# EasyEDA Pro project STM32G474RBT6直插主控.eprj

# Schematic Schematic1
Board Name: Board1; Create Date: 2026-03-23; Page Name: P1; Project Name: STM32G474RBT6直插主控; Schematic Name: Schematic1; Update Date: 2026-03-25; Company: 嘉立创EDA; Page Size: A4; Version: V1.0
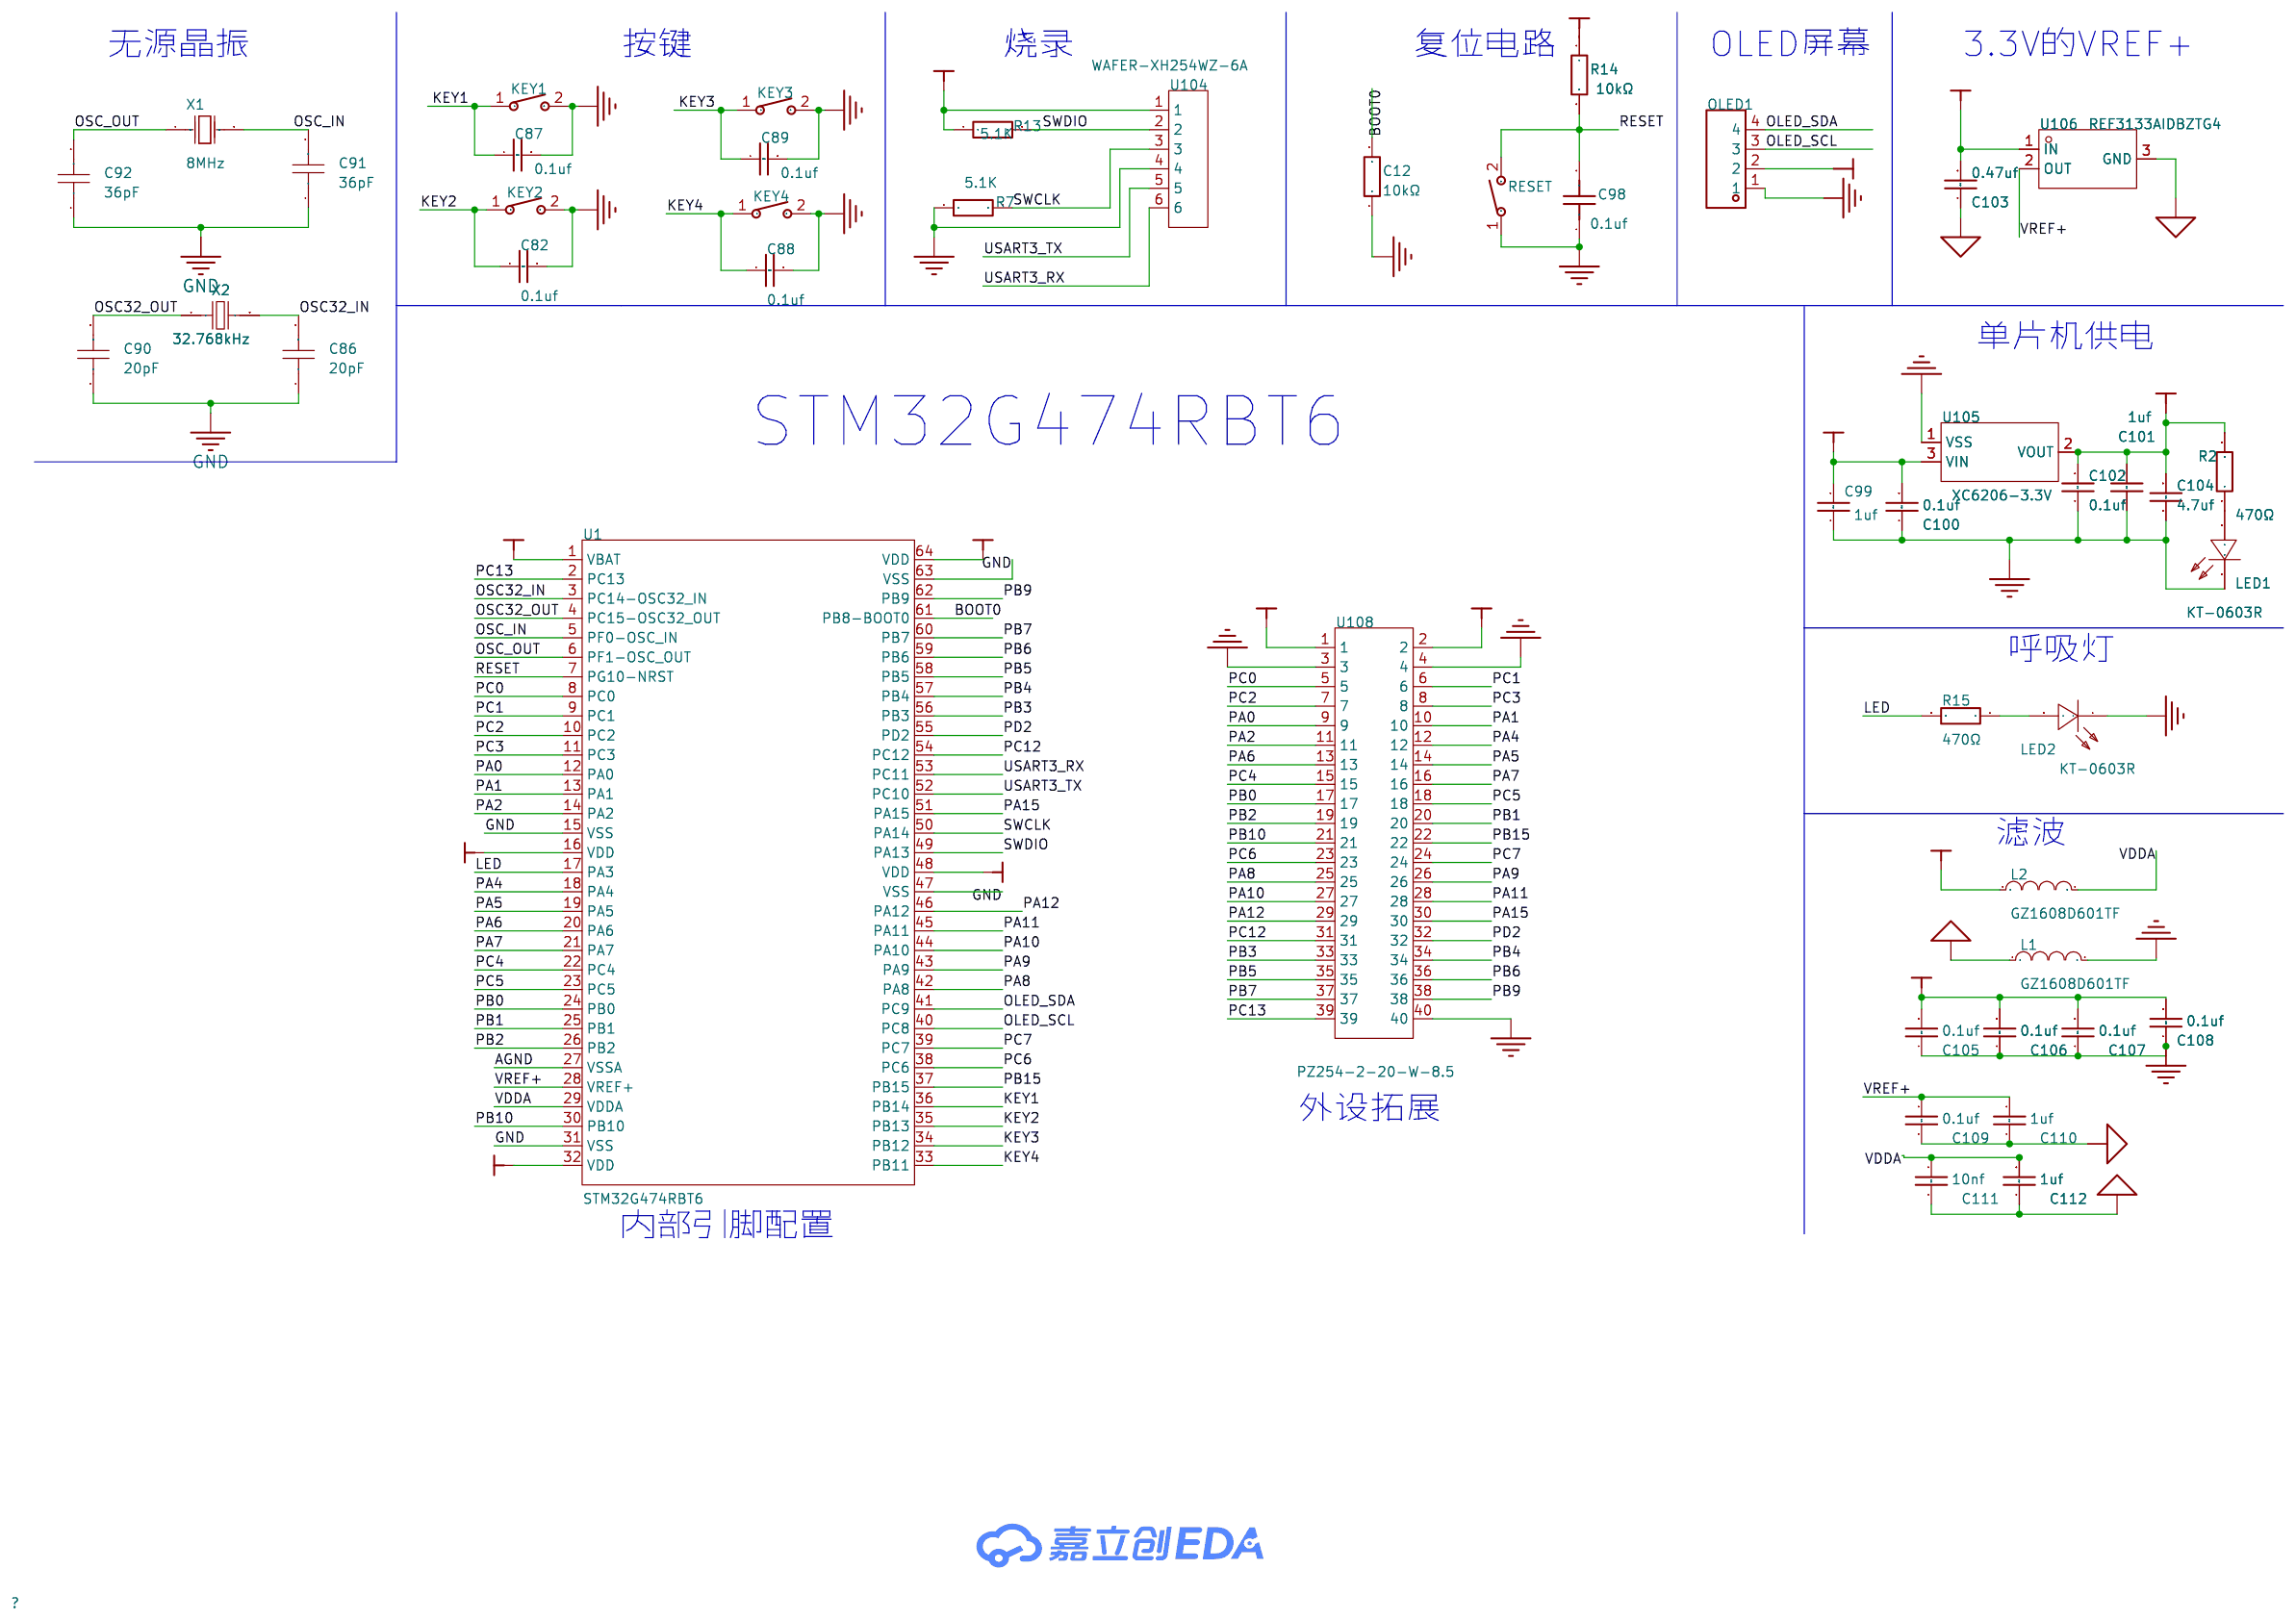
[diagram p0: schematic sheet]

## Parts
C12  10kΩ  [电阻（0603）]
C82  0.1uf  [C0603]
C86  20pF  [C0603]
C87  0.1uf  [C0603]
C88  0.1uf  [C0603]
C89  0.1uf  [C0603]
C90  20pF  [C0603]
C91  36pF  [C0603]
C92  36pF  [C0603]
C98  0.1uf  [电容（0603）]
C99  1uf  [C0603]
C100  0.1uf  [C0603]
C101  1uf  [C0603]
C102  0.1uf  [C0603]
C103  0.47uf  [C0603]
C104  4.7uf  [C0603]
C105  0.1uf  [C0603]
C106  0.1uf  [C0603]
C107  0.1uf  [C0603]
C108  0.1uf  [C0603]
C109  0.1uf  [C0603]
C110  1uf  [C0603]
C111  10nf  [C0603]
C112  1uf  [C0603]
KEY1  TS6643WS 250gf 072  [SW-SMD_L6.0-W6.0-P6.00-LS6.8]
KEY2  TS6643WS 250gf 072  [SW-SMD_L6.0-W6.0-P6.00-LS6.8]
KEY3  TS6643WS 250gf 072  [SW-SMD_L6.0-W6.0-P6.00-LS6.8]
KEY4  TS6643WS 250gf 072  [SW-SMD_L6.0-W6.0-P6.00-LS6.8]
L1  GZ1608D601TF  [L0603]
L2  GZ1608D601TF  [L0603]
LED1  KT-0603R  [LED0603-RD]
LED2  KT-0603R  [LED0603-RD]
OLED1  2.54-1*4P母  [HDR-TH_4P-P2.54-V-F]
R2  470Ω  [电阻（0603）]
R7  5.1K  [电阻（0603）]
R13  5.1K  [电阻（0603）]
R14  10kΩ  [电阻（0603）]
R15  470Ω  [电阻（0603）]
RESET  TS6643WS 250gf 072  [SW-SMD_L6.0-W6.0-P6.00-LS6.8]
U1  STM32G474RBT6  [LQFP-64_L10.0-W10.0-P0.50-LS12.0-BL]
U104  WAFER-XH254WZ-6A  [CONN-TH_6P-P2.50_WAFER-XH254WZ-6A]
U105  XC6206-3.3V  [SSOT-3_L2.9-W1.6-P0.95-LS2.8-BR]
U106  REF3133AIDBZTG4  [SOT-23-3_L2.9-W1.4-0.95-LS2.5-BR]
U108  PZ254-2-20-W-8.5  [HDR-TH_40P-P2.54-H-M-R2-C20-S2.54-W12.9-N]
X1  8MHz  [CRYSTAL-SMD_L5.0-W3.2]
X2  32.768kHz  [FC-135R_L3.2-W1.5]

## Library data of the parts
C12 = 0805W8F1002T5E_C17414: LCSC Part Name: 10kΩ ±1% 125mW; Supplier Part: C17414; Manufacturer: UNI-ROYAL(厚声); Manufacturer Part: 0805W8F1002T5E; Supplier Footprint: 0805; JLCPCB Part Class: Basic Part; Datasheet: https://atta.szlcsc.com/upload/public/pdf/source/20200306/C422600_1E6D84923E4A46A82E41ADD87F860B5C.pdf; Supplier: LCSC; Type: 厚膜电阻; Tolerance: ±1%; Power(Watts): 125mW; Temperature Coefficient: ±100ppm/℃; Overload Voltage (Max): 150V; Operating Temperature Range: -55℃~+155℃
C82 C87-C89 C99-C112 = C0603
C86 C90-C92 = CAI0603C0G470J101JT: 容值:47pF;精度:±5%;额定电压:100V;温度系数:C0G;; LCSC Part Name: 47pF ±5% 100V; Supplier Part: C46614508; Manufacturer: HRE(芯声); Supplier Footprint: 0603; JLCPCB Part Class: 扩展库; Datasheet: https://item.szlcsc.com/datasheet/CAI0603C0G470J101JT/48763034.html; Supplier: LCSC; Tolerance: ±5%; Voltage Rating: 100V; Temperature Coefficient: C0G
C98 = 电容
KEY1-KEY4 = TS6643WS 250gf 072: LCSC Part Name: 6*6*4.3mm 立贴 轻触开关 无声软胶; Supplier Part: C6364686; Manufacturer: SHOU HAN(首韩); Supplier Footprint: SMD; JLCPCB Part Class: 扩展库; Datasheet: https://atta.szlcsc.com/upload/public/pdf/source/20230523/7B21E479361B05F0C7B61E17A73CF12C.pdf; Supplier: LCSC; Circuit: 单刀单掷; Actuator Style: 圆形按钮; Operating Force: 2.5N; Mounting Style: 立贴; Switch Length: 6mm; Switch Width: 6mm; Switch Height: 4.3mm; Strike Gundam: 不带; Contact Current: 50mA; Voltage Rating (DC): 12V; Insulation Resistance: 100MΩ; Actuator/Cap Color: 黑色; With Lamp: 无; Mechanical Life: 10万次; Operating Temperature: -20℃~+70℃
L1 L2 = GZ1608D601TF: 阻抗@频率:600Ω@100MHz;误差:±25%;直流电阻(DCR):450mΩ;; LCSC Part Name: 单路 0603磁珠 阻抗600Ω@100MHz; Supplier Part: C1002; Manufacturer: Sunlord(顺络); Supplier Footprint: 0603; JLCPCB Part Class: 基础库; Datasheet: https://item.szlcsc.com/datasheet/GZ1608D601TF/1354.html; Supplier: LCSC; Impedance @ Frequency: 600Ω@100MHz; Tolerance: ±25%; DC Resistance(DCR): 450mΩ; Current Rating: 200mA; Number of Circuits: 1; Operating Temperature: -55℃~+125℃
LED1 LED2 = KT-0603R: 灯头类型:-;发光颜色:红色;正向压降(Vf):2.4V;功率:40mW;正向电流:20mA;波长:615nm~630nm;二极管配置:独立二极管;透镜颜色:无色透明透镜;色温:-;发光强度:300mcd;发光角度:120°;载带方式:-;工作温度:-40℃~+85℃;; LCSC Part Name: 0603 红灯 高亮; Supplier Part: C2286; Manufacturer: KENTO; Supplier Footprint: 0603; JLCPCB Part Class: 基础库; Datasheet: https://item.szlcsc.com/datasheet/KT-0603R/2659.html; Supplier: LCSC; Illumination Color: 红色; Voltage - Forward(Vf): 2.4V; Power(Watts): 40mW; Forward Current: 20mA; Wavelength - Dominant: 615nm~630nm; Peak Wavelength: 645nm; Diode Configuration: 独立二极管; Lens Color: 无色透明透镜; Luminous Intensity: 300mcd; Viewing Angle: 120°; Operating Temperature: -40℃~+85℃
OLED1 = 2.54-1*4P母: 插孔结构:1x4P;间距:2.54mm;行距:-;圆孔/方孔:方孔;安装类型:直插;排数:单排;总孔位数:4P;额定电流:3A;额定电压:-;插孔方向:顶部;塑高:-;触头材质:青铜;触头镀层:-;工作温度范围:-40℃~+105℃;焊接温度(最大值):-;; LCSC Part Name: 间距:2.54mm 1x4P 直插; Supplier Part: C2718488; Manufacturer: BOOMELE(博穆精密); Supplier Footprint: 插件,P=2.54mm; Datasheet: https://atta.szlcsc.com/upload/public/pdf/source/20210301/C2718488_F4427B881E42CAA8DDB0B1C12B3A522C.pdf; Supplier: LCSC; Holes Structure: 1x4P; Pitch: 2.54mm; Circular Hole / Square Hole: 方孔; Mounting Type: 直插; Number of Rows: 单排; Number of Holes: 4P; Current Rating (Max): 3A; Holes Direction: 顶部; Contact Material: 青铜; Operating Temperature Range: -40℃~+105℃
R2 R15 = 0805W8F5101T5E: 电阻类型:厚膜电阻;阻值:5.1kΩ;精度:±1%;功率:125mW;最大工作电压:150V;温度系数:±100ppm/℃;; LCSC Part Name: 5.1kΩ ±1% 125mW 厚膜电阻; Supplier Part: C27834; Manufacturer: UNI-ROYAL(厚声); Supplier Footprint: 0805; JLCPCB Part Class: Basic Part; Datasheet: https://atta.szlcsc.com/upload/public/pdf/source/20200306/C422600_1E6D84923E4A46A82E41ADD87F860B5C.pdf; Supplier: LCSC; Type: 厚膜电阻; Tolerance: ±1%; Power(Watts): 125mW; Overload Voltage (Max): 150V; Temperature Coefficient: ±100ppm/℃; Operating Temperature Range: -55℃~+155℃
R7 R13 R14 = 电阻
RESET = TS6643WS 250gf 072: 电路结构:单刀单掷;按钮形状:圆形按钮;作用力:2.5N;安装方式:立贴;开关长度:6mm;开关宽度:6mm;开关高度:4.3mm;带支架:不带;触点电流:50mA;额定电压(DC):12V;绝缘电阻:100MΩ;带灯:无;机械寿命:10万次;; LCSC Part Name: 6*6*4.3mm 立贴 轻触开关 无声软胶; Supplier Part: C6364686; Manufacturer: SHOU HAN(首韩); Supplier Footprint: SMD; JLCPCB Part Class: 扩展库; Datasheet: https://atta.szlcsc.com/upload/public/pdf/source/20230523/7B21E479361B05F0C7B61E17A73CF12C.pdf; Supplier: LCSC; Circuit: 单刀单掷; Actuator Style: 圆形按钮; Operating Force: 2.5N; Mounting Style: 立贴; Switch Length: 6mm; Switch Width: 6mm; Switch Height: 4.3mm; Strike Gundam: 不带; Contact Current: 50mA; Voltage Rating (DC): 12V; Insulation Resistance: 100MΩ; Actuator/Cap Color: 黑色; With Lamp: 无; Mechanical Life: 10万次; Operating Temperature: -20℃~+70℃
U1 = STM32G474RBT6: CPU内核:ARM-M4;CPU最大主频:170MHz;应用领域:-;; LCSC Part Name: 带DSP和FPU的170MHz主流ARM Cortex-M4 MCU，具有128 KB Flash存储器、数学加速器、高分辨率定时器和高模拟电平集成; Supplier Part: C529413; Manufacturer: ST(意法半导体); Supplier Footprint: LQFP-64(10x10); JLCPCB Part Class: 扩展库; Datasheet: https://item.szlcsc.com/datasheet/STM32G474RBT6/549641.html; Supplier: LCSC; CPU Core: ARM-M4; CPU Maximum Speed: 170MHz; Program Storage Size: 128KB; Program Memory Type: FLASH; Number of I/O: 52; ADC (Bit): 12bit; DAC (Bit): 12bit; Voltage - Supply: 1.71V~3.6V
U104 = WAFER-XH254WZ-6A: 插针结构:1x6P;间距:2.54mm;安装方式:弯插;参考系列:XH;总PIN数:6P;排数:1;每排PIN数:6;额定电流:3A;触头材质:黄铜;工作温度:-25℃~+85℃;; LCSC Part Name: 1x6P 间距:2.54mm 弯插 系列:XH; Supplier Part: C7432695; Manufacturer: HANBO(汉博); Supplier Footprint: 插件,P=2.5mm; JLCPCB Part Class: 扩展库; Datasheet: https://item.szlcsc.com/datasheet/WAFER-XH254WZ-6A/8437692.html; Supplier: LCSC; Pins Structure: 1x6P; Pitch: 2.54mm; Mounting Type: 弯插; Reference Series: XH; Number of Pins: 6P; Number of Rows: 1; Number of PINs Per Row: 6; Current Rating: 3A; Contact Material: 黄铜; Operating Temperature: -25℃~+85℃; Voltage Rating: 250V; Plastic Material: PA66; Flame Retardant Rating: UL94V-0
U105 = XC6206-3.3V: 输出类型:固定;工作电压:6V;输出电压:3.3V;输出电流:250mA;电源纹波抑制比(PSRR):-;输出极性:正极;; LCSC Part Name: 3.3V 250mA 6V; Supplier Part: C2891841; Manufacturer: YONGYUTAI(永裕泰); Supplier Footprint: SOT-23-3L; JLCPCB Part Class: 扩展库; Datasheet: https://item.szlcsc.com/datasheet/XC6206-3.3V/3119760.html; Supplier: LCSC; Output Type: 固定; Voltage - Supply: 6V; Output Voltage: 3.3V; Output Current: 250mA; Voltage Dropout: 400mV@(200mA); standby current: 3uA; Features: 过流保护; Operating Temperature: -40℃~+125℃@(Tj); Output Configuration: 正极; Number of Outputs: 1
U106 = REF3133AIDBZTG4: 输出类型:固定;工作电压:3.35V~5.5V;输出电压:3.3V;输出电流:10mA;精度:±0.2%;; Supplier Part: C21252151; Manufacturer: TI(德州仪器); Supplier: LCSC; Output Type: 固定; Voltage - Supply: 3.35V~5.5V; Output Voltage: 3.3V; Output Current: 10mA; Tolerance: ±0.2%; Reference Type: 串联; Quiescent Current: 115uA; Noise - 1/10Hz to 10Hz: 43uVp-p; Noise - 10Hz to 10kHz: 63uVrms; Operating Temperature: -40℃~+125℃
U108 = PZ254-2-20-W-8.5: 插针结构:2x20P;间距:2.54mm;行距:2.54mm;圆针/方针:方针;安装方式:弯插;排数:双排;总PIN位数:40P;额定电流:3A;额定电压:-;配合针长度:6mm;塑高:2.5mm;端接针长度:-;触头材质:黄铜;工作温度:-40℃~+105℃;颜色:黑色;; LCSC Part Name: 2x20P 间距:2.54mm 方针 弯插; Supplier Part: C3012279; Manufacturer: HCTL(华灿天禄); Supplier Footprint: 弯插,P=2.54mm; JLCPCB Part Class: 扩展库; Datasheet: https://atta.szlcsc.com/upload/public/pdf/source/20230609/1B60364E488FD8696AA7206A46578DEA.pdf; Supplier: LCSC; Pin Structure: 2x20P; Pitch: 2.54mm; Row Spacing: 2.54mm; Circluar Pins/Square Pins: 方针; Mounting Type: 弯插; Number of Rows: 双排; Number of Pins: 40P; Current Rating: 3A; Length of Mating Pin: 6mm; Insulation Height: 2.5mm; Contact Material: 黄铜; Operating Temperature: -40℃~+105℃; Color: 黑色
X1 = X50328MSB2GI: 晶振类型:贴片晶振;频率:8MHz;常温频差:±10ppm;负载电容:20pF;频率稳定度:±20ppm;; LCSC Part Name: 8MHz ±10ppm 20pF; Supplier Part: C115962; Manufacturer: YXC(扬兴晶振); Supplier Footprint: SMD5032; JLCPCB Part Class: 基础库; Datasheet: https://atta.szlcsc.com/upload/public/pdf/source/20240329/44922B0AF7B60E58E9B66993B6077277.pdf; Supplier: LCSC; Type: 贴片晶振; Normal temperature Frequency Tolerance: ±10ppm; Load Capacitance: 20pF; Frequency Stability: ±20ppm; Operating Temperature: -40℃~+85℃
X2 = Q13FC1350000400: 晶振类型:贴片无源晶振;频率:32.768kHz;频率公差:±20ppm;频率稳定度:-;负载电容:12.5pF;等效串联电阻(ESR):70kΩ;工作温度:-40~+85;; LCSC Part Name: 32.768kHz ±20ppm 12.5pF; Supplier Part: C32346; Manufacturer: EPSON(爱普生); Supplier Footprint: SMD3215-2P; JLCPCB Part Class: Basic Part; Datasheet: https://atta.szlcsc.com/upload/public/pdf/source/20190108/C32346_746D6B07EAF90824457A96480007685F.pdf; Supplier: LCSC; Crystal Type: 贴片无源晶振; Frequency Tolerance: ±20ppm; Load Capacitance: 12.5pF; Equivalent Series Resistance (ESR): 70kΩ; Operating Temperature: -40~+85

## Nets
3V3: C101.2 C102.2 C104.2 C105.2 C106.2 C107.2 C108.2 L2.1 OLED1.2 R2.2 R13.1 R14.1 U1.1(VBAT) U1.16(VDD) U1.32(VDD) U1.48(VDD) U1.64(VDD) U104.1 U105.2(VOUT)
5V: C99.2 C100.2 C103.2 U105.3(VIN) U106.1(IN) U108.1 U108.2
AGND: C103.1 C109.1 C110.1 C111.1 C112.1 L1.1 U1.27(VSSA) U106.3(GND)
GND: C12.1 C82.2 C86.1 C87.2 C88.2 C89.2 C90.1 C91.1 C92.1 C98.1 C99.1 C100.1 C101.1 C102.1 C104.1 C105.1 C106.1 C107.1 C108.1 KEY1.2 KEY2.2 KEY3.2 KEY4.2 L1.2 LED1.1(K) LED2.1(K) OLED1.1 R7.1 RESET.1 U1.15(VSS) U1.31(VSS) U1.47(VSS) U1.63(VSS) U104.4 U105.1(VSS) U108.3 U108.4 U108.40
VDDA: C111.2 C112.2 L2.2 U1.29(VDDA)
BOOT0: C12.2 U1.61(PB8-BOOT0)
KEY1: C87.1 KEY1.1 U1.36(PB14)
KEY2: C82.1 KEY2.1 U1.35(PB13)
KEY3: C89.1 KEY3.1 U1.34(PB12)
KEY4: C88.1 KEY4.1 U1.33(PB11)
LED: R15.2 U1.17(PA3)
OLED_SCL: OLED1.3 U1.40(PC8)
OLED_SDA: OLED1.4 U1.41(PC9)
OSC32_IN: C86.2 U1.3(PC14-OSC32_IN) X2.2
OSC32_OUT: C90.2 U1.4(PC15-OSC32_OUT) X2.1
OSC_IN: C91.2 U1.5(PF0-OSC_IN) X1.2(OSC2)
OSC_OUT: C92.2 U1.6(PF1-OSC_OUT) X1.1(OSC1)
PA0: U1.12(PA0) U108.9
PA1: U1.13(PA1) U108.10
PA2: U1.14(PA2) U108.11
PA4: U1.18(PA4) U108.12
PA5: U1.19(PA5) U108.14
PA6: U1.20(PA6) U108.13
PA7: U1.21(PA7) U108.16
PA8: U1.42(PA8) U108.25
PA9: U1.43(PA9) U108.26
PA10: U1.44(PA10) U108.27
PA11: U1.45(PA11) U108.28
PA12: U1.46(PA12) U108.29
PA15: U1.51(PA15) U108.30
PB0: U1.24(PB0) U108.17
PB1: U1.25(PB1) U108.20
PB2: U1.26(PB2) U108.19
PB3: U1.56(PB3) U108.33
PB4: U1.57(PB4) U108.34
PB5: U1.58(PB5) U108.35
PB6: U1.59(PB6) U108.36
PB7: U1.60(PB7) U108.37
PB9: U1.62(PB9) U108.38
PB10: U1.30(PB10) U108.21
PB15: U1.37(PB15) U108.22
PC0: U1.8(PC0) U108.5
PC1: U1.9(PC1) U108.6
PC2: U1.10(PC2) U108.7
PC3: U1.11(PC3) U108.8
PC4: U1.22(PC4) U108.15
PC5: U1.23(PC5) U108.18
PC6: U1.38(PC6) U108.23
PC7: U1.39(PC7) U108.24
PC12: U1.54(PC12) U108.31
PC13: U1.2(PC13) U108.39
PD2: U1.55(PD2) U108.32
RESET: C98.2 R14.2 RESET.2 U1.7(PG10-NRST)
SWCLK: R7.2 U1.50(PA14) U104.3
SWDIO: R13.2 U1.49(PA13) U104.2
USART3_RX: U1.53(PC11) U104.6
USART3_TX: U1.52(PC10) U104.5
VREF+: C109.2 C110.2 U1.28(VREF+) U106.2(OUT)
$1N2899: LED1.2(A) R2.1
$1N3104: LED2.2(A) R15.1

## Notes on the sheet
- OLED屏幕
- 3.3V的VREF+
- 无源晶振
- 按键
- 烧录
- 复位电路
- 单片机供电
- STM32G474RBT6
- 呼吸灯
- 滤波
- 外设拓展
- 内部引脚配置

# Board PCB1
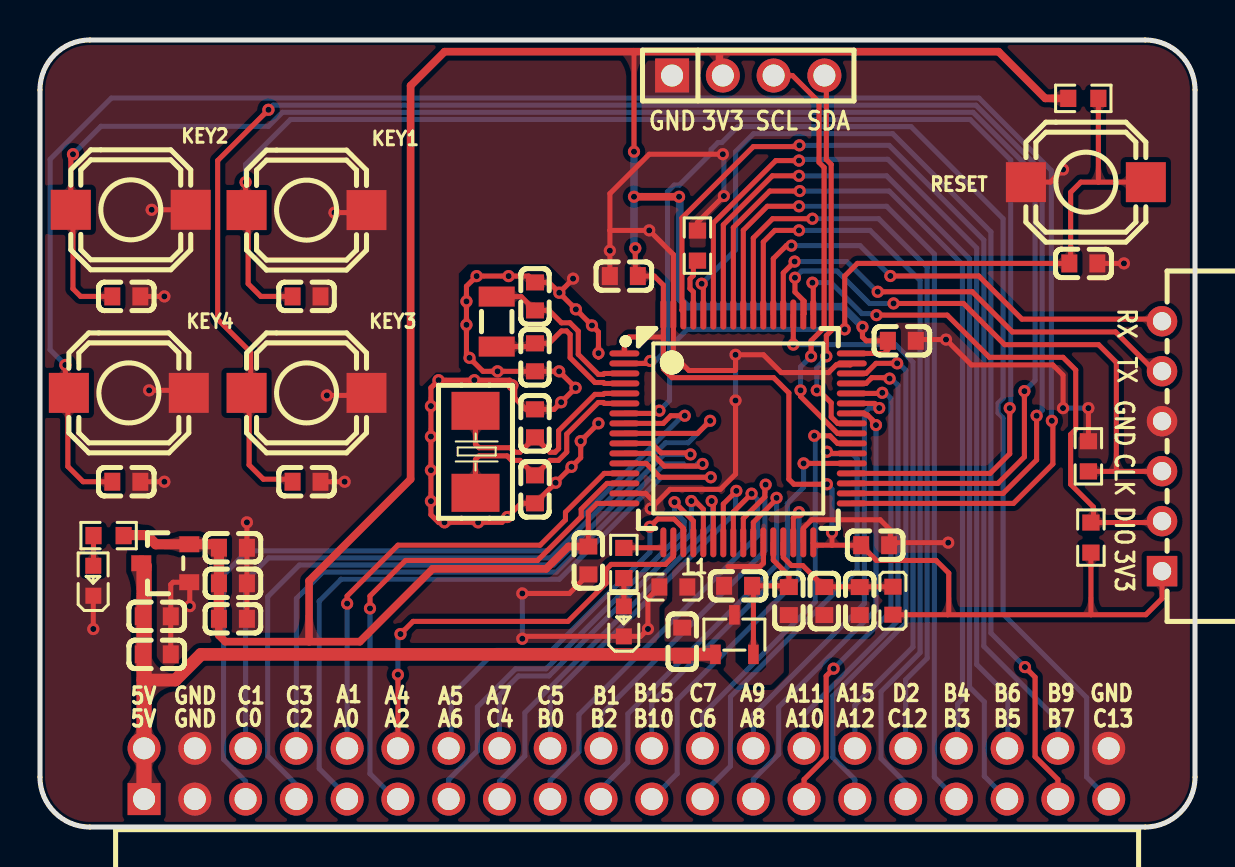
[diagram p1: board, top side]
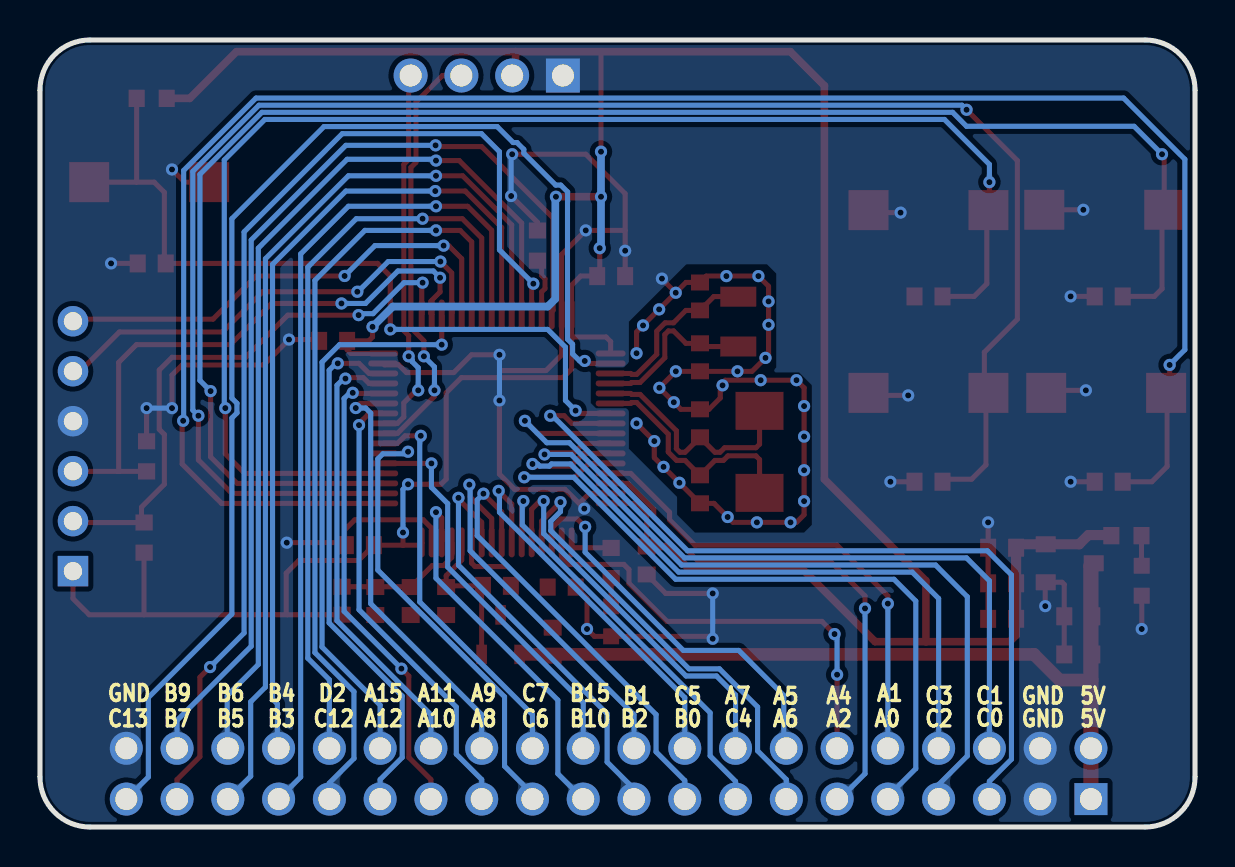
[diagram p2: board, bottom side, seen from below]

Outline 57.78 x 39.37 mm; copper layers: Top Layer, Bottom Layer. Coordinates in mm from the lower left corner of the outline.
Outline path: 0,36.87 0,2.5 arc(0.73,0.73) 2.5,0 55.28,0 arc(57.05,0.73) 57.78,2.5 57.78,36.87 arc(57.05,38.64) 55.28,39.37 2.5,39.37 arc(0.73,38.64) 0,36.87
Stack: Top Layer 0.035mm / Dielectric1 1.51mm FR4 er 4.5 / Bottom Layer 0.035mm

## Design rules (mm)
net OSC32_IN: DP1
net OSC32_OUT: DP1
net OSC_IN: DP2
net OSC_OUT: DP2
template: 自定义配置
spacing copperThickness1oz (default): track to track 0.102, other pairs 0.152 to 0.3
spacing copperThickness2oz: track to track 0.203, other pairs 0.152 to 0.3
track width copperThickness1oz (default): min 0.127, default 0.254, max 2.54
track width copperThickness2oz: min 0.203, default 0.254, max 2.54
differential pair differentialPair (default): width min 0.127, default 0.254, max 2.54; gap min 0.152, default 0.152
via viaSize (default): diameter min 0.5, default 0.61, max 10; hole min 0.3, default 0.305, max 6.3

## Placement (name value [footprint] x y rotation side)
C12  10kΩ  [电阻（0603）]  32.89 29.08 270 top
C82  0.1uf  [C0603]  4.32 26.54 0 top
C86  20pF  [C0603]  24.77 26.54 270 top
C87  0.1uf  [C0603]  13.34 26.54 0 top
C88  0.1uf  [C0603]  4.32 17.27 0 top
C89  0.1uf  [C0603]  13.34 17.27 0 top
C90  20pF  [C0603]  24.77 23.5 90 top
C91  36pF  [C0603]  24.77 20.19 270 top
C92  36pF  [C0603]  24.77 16.89 90 top
C98  0.1uf  [电容（0603）]  52.2 28.19 180 top
C99  1uf  [C0603]  5.84 8.64 180 top
C100  0.1uf  [C0603]  5.84 10.54 180 top
C101  1uf  [C0603]  9.65 12.19 180 top
C102  0.1uf  [C0603]  9.65 13.97 180 top
C103  0.47uf  [C0603]  32.13 9.27 270 top
C104  4.7uf  [C0603]  9.65 10.41 180 top
C105  0.1uf  [C0603]  41.78 14.1 180 top
C106  0.1uf  [C0603]  27.43 13.34 90 top
C107  0.1uf  [C0603]  29.21 27.56 0 top
C108  0.1uf  [C0603]  43.12 24.32 180 top
C109  0.1uf  [C0603]  34.93 12.07 0 top
C110  1uf  [C0603]  37.47 11.3 90 top
C111  10nf  [C0603]  41.01 11.3 90 top
C112  1uf  [C0603]  39.24 11.3 90 top
KEY1  TS6643WS 250gf 072  [SW-SMD_L6.0-W6.0-P6.00-LS6.8]  13.34 30.86 0 top
KEY2  TS6643WS 250gf 072  [SW-SMD_L6.0-W6.0-P6.00-LS6.8]  4.54 30.88 0 top
KEY3  TS6643WS 250gf 072  [SW-SMD_L6.0-W6.0-P6.00-LS6.8]  13.34 21.72 0 top
KEY4  TS6643WS 250gf 072  [SW-SMD_L6.0-W6.0-P6.00-LS6.8]  4.45 21.72 0 top
L1  GZ1608D601TF  [L0603]  31.69 12 180 top
L2  GZ1608D601TF  [L0603]  42.67 11.32 90 top
LED1  KT-0603R  [LED0603-RD]  2.67 12.32 90 top
LED2  KT-0603R  [LED0603-RD]  29.21 10.29 90 top
OLED1  2.54-1*4P母  [HDR-TH_4P-P2.54-V-F]  35.43 37.59 0 top
R2  470Ω  [电阻（0603）]  3.43 14.58 180 top
R7  5.1K  [电阻（0603）]  52.45 18.54 270 top
R13  5.1K  [电阻（0603）]  52.58 14.48 90 top
R14  10kΩ  [电阻（0603）]  52.2 36.45 0 top
R15  470Ω  [电阻（0603）]  29.21 13.21 90 top
RESET  TS6643WS 250gf 072  [SW-SMD_L6.0-W6.0-P6.00-LS6.8]  52.32 32.26 0 top
U1  STM32G474RBT6  [LQFP-64_L10.0-W10.0-P0.50-LS12.0-BL]  34.93 19.94 270 top
U104  WAFER-XH254WZ-6A  [CONN-TH_6P-P2.50_WAFER-XH254WZ-6A]  56.13 19.05 90 top
U105  XC6206-3.3V  [SSOT-3_L2.9-W1.6-P0.95-LS2.8-BR]  6.27 13.19 0 top
U106  REF3133AIDBZTG4  [SOT-23-3_L2.9-W1.4-0.95-LS2.5-BR]  34.74 9.62 270 top
U108  PZ254-2-20-W-8.5  [HDR-TH_40P-P2.54-H-M-R2-C20-S2.54-W12.9-N]  29.34 2.67 0 top
X1  8MHz  [CRYSTAL-SMD_L5.0-W3.2]  21.79 18.77 90 top
X2  32.768kHz  [FC-135R_L3.2-W1.5]  22.85 25.28 90 top

## Footprints (pads in the part's own frame, mm; a bottom-side part is the same pattern mirrored in y, then rotated)
C0603
  rect 0.8x0.9 smd: 1(-0.7,0) 2(0.7,0)
CONN-TH_6P-P2.50_WAFER-XH254WZ-6A
  rect 1.524x1.524 hole 0.914: 1(-6.25,0)
  round 1.524 hole 0.914: 2(-3.75,0) 3(-1.25,0) 4(1.25,0) 5(3.75,0) 6(6.25,0)
CRYSTAL-SMD_L5.0-W3.2
  rect 1.9x2.4 smd: 1(-2.05,0) 2(2.05,0)
FC-135R_L3.2-W1.5
  rect 1.001x1.801 smd: 1(-1.25,0) 2(1.25,0)
HDR-TH_4P-P2.54-V-F
  rect 1.7x1.7 hole 1.1: 1(-3.81,0)
  round 1.7 hole 1.1: 2(-1.27,0) 3(1.27,0) 4(3.81,0)
HDR-TH_40P-P2.54-H-M-R2-C20-S2.54-W12.9-N
  rect 1.65x1.6 hole 1.1: 1(-24.13,-1.27)
  round 1.65 hole 1.1: 2(-24.13,1.27) 3(-21.59,-1.27) 4(-21.59,1.27) 5(-19.05,-1.27) 6(-19.05,1.27) 7(-16.51,-1.27) 8(-16.51,1.27) 9(-13.97,-1.27) 10(-13.97,1.27) 11(-11.43,-1.27) 12(-11.43,1.27) 13(-8.89,-1.27) 14(-8.89,1.27) 15(-6.35,-1.27) 16(-6.35,1.27) 17(-3.81,-1.27) 18(-3.81,1.27) 19(-1.27,-1.27) 20(-1.27,1.27) 21(1.27,-1.27) 22(1.27,1.27) 23(3.81,-1.27) 24(3.81,1.27) 25(6.35,-1.27) 26(6.35,1.27) 27(8.89,-1.27) 28(8.89,1.27) 29(11.43,-1.27) 30(11.43,1.27) 31(13.97,-1.27) 32(13.97,1.27) 33(16.51,-1.27) 34(16.51,1.27) 35(19.05,-1.27) 36(19.05,1.27) 37(21.59,-1.27) 38(21.59,1.27) 39(24.13,-1.27) 40(24.13,1.27)
L0603
  rect 0.8x0.864 smd: 1(-0.7,0) 2(0.7,0)
LED0603-RD
  rect 0.8x0.8 smd: 1(-0.749,0) 2(0.749,0)
LQFP-64_L10.0-W10.0-P0.50-LS12.0-BL
  oval 0.3x1.5 smd: 1(-3.75,-5.688) 2(-3.25,-5.688) 3(-2.75,-5.688) 4(-2.25,-5.688) 5(-1.75,-5.688) 6(-1.25,-5.688) 7(-0.75,-5.688) 8(-0.25,-5.688) 9(0.25,-5.688) 10(0.75,-5.688) 11(1.25,-5.688) 12(1.75,-5.688) 13(2.25,-5.688) 14(2.75,-5.688) 15(3.25,-5.688) 16(3.75,-5.688) 33(3.75,5.688) 34(3.25,5.688) 35(2.75,5.688) 36(2.25,5.688) 37(1.75,5.688) 38(1.25,5.688) 39(0.75,5.688) 40(0.25,5.688) 41(-0.25,5.688) 42(-0.75,5.688) 43(-1.25,5.688) 44(-1.75,5.688) 45(-2.25,5.688) 46(-2.75,5.688) 47(-3.25,5.688) 48(-3.75,5.688)
  oval 1.5x0.3 smd: 17(5.7,-3.738) 18(5.7,-3.238) 19(5.7,-2.738) 20(5.7,-2.238) 21(5.7,-1.738) 22(5.7,-1.238) 23(5.7,-0.739) 24(5.7,-0.238) 25(5.7,0.262) 26(5.7,0.762) 27(5.7,1.262) 28(5.7,1.762) 29(5.7,2.261) 30(5.7,2.762) 31(5.7,3.261) 32(5.7,3.762) 49(-5.7,3.762) 50(-5.7,3.261) 51(-5.7,2.762) 52(-5.7,2.261) 53(-5.7,1.762) 54(-5.7,1.262) 55(-5.7,0.762) 56(-5.7,0.262) 57(-5.7,-0.238) 58(-5.7,-0.739) 59(-5.7,-1.238) 60(-5.7,-1.738) 61(-5.7,-2.238) 62(-5.7,-2.738) 63(-5.7,-3.238) 64(-5.7,-3.738)
SOT-23-3_L2.9-W1.4-0.95-LS2.5-BR
  rect 0.978x0.532 smd: 1(0.989,-0.95) 2(0.989,0.95) 3(-0.989,0)
SSOT-3_L2.9-W1.6-P0.95-LS2.8-BR
  rect 1x0.8 smd: 1(1.2,-0.95) 2(1.2,0.95) 3(-1.2,0)
SW-SMD_L6.0-W6.0-P6.00-LS6.8
  rect 2x2 smd: 1(-3,0) 2(3,0)
电容（0603）
  rect 0.8x0.9 smd: 1(-0.7,0) 2(0.7,0)
电阻（0603）
  rect 0.806x0.864 smd: 1(-0.754,0) 2(0.752,0)

## Nets
As in the schematic.

## Via types
v1: diameter 0.61, hole 0.305, Top Layer to Bottom Layer, 121 vias

## Routing (per net, layer and track width the routed paths; a pad name or vN(x,y) marks a point on that pad's centre or on a via; arc(x,y) is an arc through that point)
3V3: length 184.1
  Top Layer w0.254: 31.19,24.5 31.19,22.92 31.62,22.48 36.7,22.48 37.47,21.72 37.47,17.4 37.72,17.15 v1(39.37,17.15) ; 31.19,24.5 31.18,24.51 29.46,24.51 29.24,24.28 U1.1 ; 31.19,24.5 U1.64 31.19,27.11 30.73,27.56 C107.2 29.78,27.69 v1(29.78,28.96) ; L2.1 45.41,10.62 ; 45.41,10.62 55.32,10.62 56.13,11.43 U104.1 ; 45.41,10.62 45.47,10.68 45.47,12.7 44.83,13.34 41.84,13.34 41.08,14.1 39.62,14.1 ; U1.32 38.69,14.19 38.78,14.1 39.62,14.1 ; 39.62,14.1 v1(39.62,14.73) ; R13.1 52.58,10.62 ; U1.16 27.87,16.19 27.43,15.75 C106.2 ; v1(41.15,25.02) 41.15,24.51 41.34,24.32 C108.2 42.42,23.88 42.23,23.69 U1.48 ; 29.7,38.78 29.72,38.77 v1(29.72,33.78)
  Top Layer w0.381: 33.99,38.78 47.96,38.78 50.29,36.45 R14.1 ; 33.99,38.78 20.24,38.78 18.54,37.08 18.54,17.4 13.46,12.32 13.46,9.27 ; 33.99,38.78 33.99,37.9 ; C104.2 8.95,9.59 9.27,9.27 13.46,9.27 ; 13.46,9.27 16,9.27 19.65,12.92 25.32,12.92 26.44,14.04 C106.2 ; v1(31.97,31.53) v1(29.72,31.53)
  Top Layer w0.508: 4.18,14.58 4.21,14.61 5.33,14.61 5.79,14.14 U105.2 8.78,14.14 C102.2 C101.2 C104.2
  Bottom Layer w0.254: v1(39.62,14.73) 39.62,16.89 v1(39.37,17.15)
  Bottom Layer w0.381: v1(29.78,28.96) 29.72,29.02 v1(29.72,31.53) v1(29.72,33.78) ; v1(41.15,25.02) 40.13,26.04 32.38,26.04 32,26.42 32,31.5 v1(31.97,31.53)
5V: length 41
  Top Layer w0.635: 33.79,8.64 8.06,8.64 6.77,7.35 5.21,7.35
  Top Layer w0.762: 5.21,1.4 5.21,13.06 U105.3
AGND: length 2.9
  Top Layer w0.254: U1.27 36.19,14.23 36.19,13.21 36.02,13.03 34.42,13.03
GND: length 157.2
  Top Layer w0.254: v1(34.21,31.56) 32.89,30.24 C12.1 ; C107.1 v1(28.51,28.83) 28.51,29.85 ; v1(45.44,14.22) 42.61,14.22 42.55,14.16 ; 30.73,16.11 30.73,16.26 30.3,16.69 U1.15 ; 30.73,16.11 v1(30.55,15.93) ; 30.73,16.11 31.52,16.89 34.04,16.89 34.8,17.65 v1(34.8,21.34) ; C98.1 v1(54.23,28.19) ; 16.46,21.84 16.21,21.59 v1(14.35,21.59) ; v1(51.18,20.96) 51.18,22.61 50.67,23.11 46.6,23.11 v1(45.33,24.38) 43.88,24.38 C108.1 ; 30.61,29.72 31.69,28.64 U1.63 31.69,23.61 32.47,22.84 34.77,22.84 34.8,22.86 v1(34.8,23.62) 36.19,23.62 37.08,22.73 39.45,22.73 39.84,23.12 40.54,23.12 U1.47 ; KEY4.2 7.32,21.84 v1(5.46,21.84) ; C105.1 42.55,14.16 ; 42.55,14.16 42.55,14.86 42.04,15.37 38.61,15.37 38.19,14.95 U1.31 ; v1(14.73,30.73) 16.21,30.73 KEY1.2 ; v1(27.94,20.19) v1(27.05,19.3) 27.05,18.48 v1(26.59,18.02) v1(25.8,17.22) C92.1 24.06,16.19 v1(23.38,15.51) 23.11,15.24 v1(21.92,15.24) 19.94,15.24 19.56,15.62 v1(19.56,16.3) v1(19.56,17.85) v1(19.56,19.53) v1(19.56,21.06) 19.56,21.97 v1(19.94,22.35) v1(21.73,22.35) 23.5,22.35 23.75,22.1 23.75,21.46 24.32,20.89 C91.1 25.72,20.89 v1(26.07,21.25) v1(26.8,21.97) v1(25.97,22.8) C90.1 v1(22.89,22.8) 22.16,22.8 21.34,23.62 v1(21.34,25.12) v1(21.34,26.29) 21.34,27.05 v1(21.84,27.56) v1(23.44,27.56) 24.45,27.56 C86.1 25.46,27.24 v1(25.98,26.73) ; R7.1 v1(52.45,20.96) ; L1.2 30.42,11.44 v1(30.42,9.91) 30.05,9.54 LED2.1 24.25,9.54 v1(24.13,9.42) ; v1(24.13,11.68) 26.48,11.68 C106.1 ; C104.1 C101.1 C102.1 v1(10.35,15.24) ; 28.51,29.85 28.51,31.69 30.48,33.66 v1(34.16,33.66) ; 28.51,29.85 v1(30.48,29.85) ; LED1.1 v1(2.67,9.91) ; C88.2 v1(6.22,17.27) ; 27.94,23.5 27.94,24.77 v1(27.61,25.09) v1(26.81,25.9) v1(25.98,26.73) ; KEY2.2 v1(5.59,30.88) ; v1(25.98,26.73) 26.67,27.42 v1(26.67,27.43) ; v1(51.18,32.89) 50.55,32.26 RESET.1 ; v1(7.49,11.05) 7.49,12.22 U105.1 6.66,12.24 6.54,12.13 C100.1 C99.1 ; C82.2 v1(6.22,26.54) ; C89.2 v1(15.24,17.27)
  Top Layer w0.381: 31.24,37.47 31.62,37.85
  Bottom Layer w0.254: v1(34.16,33.66) 34.21,33.6 v1(34.21,31.56) ; v1(34.8,21.34) v1(34.8,23.62) ; v1(51.18,20.96) v1(52.45,20.96) ; v1(24.13,9.42) v1(24.13,11.68)
  vias: v1(20.24,15.24) v1(21.49,23.47) v1(23.64,22.09) v1(27.94,23.7)
VDDA: length 6.9
  Top Layer w0.254: L2.2 39.25,12.02 C112.2 38.16,13.08 37.59,13.08 37.19,13.49 U1.29
BOOT0: length 2.9
  Top Layer w0.254: U1.61 32.69,26.77 32.52,26.94 32.52,27.42 32.69,27.59 32.69,28.12 C12.2
KEY1: length 72.1
  Top Layer w0.254: 10.29,31.3 10.41,31.17 10.41,27.18 11.05,26.54 12.51,26.54 12.63,26.67 ; 10.29,31.3 10.29,30.91 KEY1.1 ; 10.29,31.3 v1(10.29,32.26) ; U1.36 47.53,17.69 48.51,18.67 v1(48.51,20.96)
  Bottom Layer w0.254: v1(10.29,32.26) 10.29,33.15 12.53,35.4 46.53,35.4 48.56,33.36 48.56,21.01 v1(48.51,20.96)
KEY2: length 82.8
  Top Layer w0.254: U1.35 47.92,17.19 49.25,18.52 v1(49.25,21.81) ; C82.1 2.03,26.54 1.65,26.92 1.65,30.77 KEY2.1 1.54,33.55 v1(1.65,33.66)
  Bottom Layer w0.254: v1(49.25,21.81) 49.78,22.34 49.78,32.65 46.68,35.75 12.13,35.75 11.43,35.05 3.05,35.05 v1(1.65,33.66)
KEY3: length 86.7
  Top Layer w0.254: v1(11.43,35.88) 8.89,33.34 8.89,25.4 10.54,23.75 10.54,21.92 10.46,21.84 10.46,18.11 11.18,17.4 12.51,17.4 12.63,17.53 ; v1(49.86,20.57) 49.86,18.36 48.19,16.69 U1.34
  Bottom Layer w0.254: v1(11.43,35.88) 11.66,36.11 46.83,36.11 50.14,32.8 50.14,20.85 v1(49.86,20.57)
KEY4: length 96.8
  Top Layer w0.254: 3.75,17.27 2.16,17.27 1.4,18.03 1.4,21.49 1.27,21.61 v1(1.27,23.11) ; v1(50.62,20.32) 50.67,20.27 50.67,18.16 48.7,16.19 U1.33
  Bottom Layer w0.254: v1(1.27,23.11) 0.51,23.88 0.51,33.4 3.57,36.46 46.98,36.46 50.6,32.84 50.6,20.35 v1(50.62,20.32)
LED: length 2.3
  Top Layer w0.254: 29.21,14.09 29.33,13.97 31.19,13.97 U1.17
OLED_SCL: length 21.5
  Top Layer w0.254: v1(38.58,23.55) 38.58,24.32 39.23,24.97 39.23,33 38.97,33.25 38.97,36.26 37.65,37.59 OLED1.3 ; v1(38.05,21.84) 38.05,21.54 39.9,19.69 U1.40
  Bottom Layer w0.254: v1(38.05,21.84) 38.05,23.02 v1(38.58,23.55)
OLED_SDA: length 19
  Top Layer w0.254: U1.41 39.91,20.19 39.58,20.51 39.58,21.22 38.96,21.84 v1(38.86,21.84) ; OLED1.4 39.34,37.49 39.34,33.39 39.58,33.14 39.58,24.83 39.34,24.58 v1(39.34,23.55)
  Bottom Layer w0.254: v1(39.34,23.55) 39.16,23.37 39.16,23.28 38.86,22.98 v1(38.86,21.84)
OSC32_IN: length 8.7
  Top Layer w0.254: U1.3 28.23,22.69 28.19,22.64 27.93,22.64 26.93,23.64 26.93,24.8 26.51,25.22 26.09,25.22 25.47,25.84 C86.2 24.08,26.53 X2.2
OSC32_OUT: length 8.5
  Top Layer w0.254: U1.4 28.23,22.19 28.19,22.24 27.76,22.24 26.52,23.48 26.52,24.64 26.34,24.82 26.09,24.82 25.47,24.2 C90.2 24.6,24.03 X2.1
OSC_IN: length 11.7
  Top Layer w0.254: U1.5 28.23,21.69 28.19,21.64 27.76,21.64 25.95,19.83 25.95,18.93 25.77,18.75 25.51,18.75 C91.2 24.02,18.75 23.76,18.75 23.54,18.97 21.97,18.97 21.79,19.15 X1.2
OSC_OUT: length 11.7
  Top Layer w0.254: X1.1 21.79,18.39 21.97,18.57 23.37,18.57 23.59,18.34 24.02,18.34 C92.2 25.51,18.34 25.94,18.34 26.35,18.76 26.35,19.66 27.93,21.24 28.19,21.24 28.23,21.19 U1.6
PA0: length 37.1
  Top Layer w0.254: U1.12 30.33,18.19 31.02,17.5 v1(33.56,17.5)
  Bottom Layer w0.254: 15.37,1.52 13.97,2.92 13.97,11.3 15.06,12.39 25.98,12.39 31.08,17.5 v1(33.56,17.5)
PA1: length 24.3
  Top Layer w0.254: U1.13 28.23,17.69 26.29,15.75 26.29,15.37 25.02,14.1 17.91,14.1 15.37,11.56 v1(15.37,11.18)
  Bottom Layer w0.254: v1(15.37,11.18) U108.10
PA2: length 25.9
  Top Layer w0.254: U1.14 28.37,17.19 27.08,15.9 27.08,15.52 24.89,13.34 18.29,13.34 16.51,11.56 v1(16.51,10.93)
  Bottom Layer w0.254: v1(16.51,10.93) 16.51,2.67 17.4,1.78 17.91,1.78
PA4: length 22.1
  Top Layer w0.254: v1(18.03,9.65) 18.67,10.29 26.42,10.29 28.32,12.19 28.32,12.88 28.58,13.14 31.29,13.14 31.69,13.53 U1.18 ; U108.12 v1(17.91,7.62)
  Bottom Layer w0.254: v1(18.03,9.65) 17.91,9.53 v1(17.91,7.62)
PA5: length 19.6
  Top Layer w0.254: U1.19 32.19,14.95 31.72,15.41 30.9,15.41 v1(30.51,15.02)
  Bottom Layer w0.254: 20.39,4 20.57,4.19 20.57,6.58 22.83,8.83 25.6,8.83 30.51,13.75 v1(30.51,15.02)
PA6: length 23.2
  Top Layer w0.254: v1(31.74,16.25) 32.69,15.31 U1.20
  Bottom Layer w0.254: v1(31.74,16.25) 31.74,15.78 32.23,15.29 32.23,14.83 25.32,7.91 23.79,7.91 21.88,6 21.88,3.81 20.45,2.38 20.45,1.4
PA7: length 19.7
  Top Layer w0.254: U1.21 33.19,15.9 32.76,16.32 32.6,16.32 v1(32.59,16.31)
  Bottom Layer w0.254: v1(32.59,16.31) 32.59,14.68 25.46,7.56 23.94,7.56 22.99,6.6 22.99,3.94
PA8: length 22.7
  Top Layer w0.254: v1(41.82,20.11) 41.64,20.29 41.64,20.37 41.39,20.62 41.31,20.62 41.24,20.69 U1.42
  Bottom Layer w0.254: v1(41.82,20.11) 41.82,10.87 36.96,6 36.96,3.65 35.69,2.38 U108.25
PA9: length 21.4
  Top Layer w0.254: U1.43 41.76,21.19 v1(41.99,20.96)
  Bottom Layer w0.254: U108.26 35.69,5.62 41.24,11.17 41.24,20.71 41.49,20.96 v1(41.99,20.96)
PA10: length 23.9
  Top Layer w0.254: v1(42.14,21.72) 42.11,21.69 U1.44 ; U108.27 38.23,2.38 39.33,3.48 39.33,7.55 v1(39.7,7.92)
  Bottom Layer w0.254: v1(39.7,7.92) 42.57,10.79 42.57,21.44 42.29,21.72 v1(42.14,21.72)
PA11: length 22.7
  Top Layer w0.254: U1.45 41.32,22.19 41.61,22.48 42.46,22.48 v1(42.5,22.43)
  Bottom Layer w0.254: U108.28 38.23,5.62 42.93,10.32 42.93,22.1 42.59,22.43 v1(42.5,22.43)
PA12: length 26.5
  Top Layer w0.254: v1(42.88,23.19) 41.83,23.19 41.32,22.69 U1.46
  Bottom Layer w0.254: v1(42.88,23.19) 42.97,23.19 43.32,22.85 43.32,10.21 39.66,6.55 39.66,3.48 40.77,2.38 40.77,1.4
PA15: length 28.4
  Top Layer w0.254: U1.51 v1(37.69,24.13)
  Bottom Layer w0.254: 40.77,3.94 40.77,6.1 43.68,9 43.68,23.25 42.8,24.13 v1(37.69,24.13)
PB0: length 22.5
  Top Layer w0.254: U1.24 34.69,15.76 v1(35.6,16.67)
  Bottom Layer w0.254: U108.17 25.53,2.33 26.96,3.76 26.96,5.63 35.91,14.57 35.91,16.37 v1(35.6,16.67)
PB1: length 20
  Top Layer w0.254: v1(36.3,17.13) 36.27,17.09 36.27,16.51 35.19,15.44 U1.25
  Bottom Layer w0.254: v1(36.3,17.13) 36.27,17.09 36.27,13.82 28.07,5.62 U108.20
PB2: length 20.9
  Top Layer w0.254: U1.26 35.69,15.24 36.85,16.4 v1(36.85,16.47)
  Bottom Layer w0.254: 28.07,1.91 29.41,3.25 29.41,5.66 36.85,13.1 v1(36.85,16.47)
PB3: length 43
  Top Layer w0.254: U1.56 35.19,29.85 36.38,31.05 v1(37.97,31.05)
  Bottom Layer w0.254: U108.33 44.74,2.5 44.74,28.66 42.36,31.05 v1(37.97,31.05)
PB4: length 42.3
  Top Layer w0.254: v1(38.01,31.81) 36.51,31.81 34.69,29.99 U1.57
  Bottom Layer w0.254: v1(38.01,31.81) 42.48,31.81 46.15,28.15 46.15,6.4 45.91,6.16 45.91,4
PB5: length 47.3
  Top Layer w0.254: U1.58 34.19,30.12 36.64,32.58 v1(37.97,32.58)
  Bottom Layer w0.254: 48.39,1.4 47.24,2.54 47.24,6.26 46.51,7 46.51,28.42 42.36,32.58 v1(37.97,32.58)
PB6: length 46.6
  Top Layer w0.254: v1(37.97,33.34) 36.81,33.34 33.69,30.21 U1.59
  Bottom Layer w0.254: v1(37.97,33.34) 38.04,33.4 42.42,33.4 46.86,28.96 46.86,8.13 48.42,6.57 48.42,3.97 48.39,3.94
PB7: length 53.8
  Top Layer w0.254: v1(49.28,8) 49.78,7.49 49.78,3.52 50.93,2.38 50.93,1.4 ; v1(33.1,27.18) 33.19,27.09 U1.60
  Bottom Layer w0.254: v1(33.1,27.18) 34.8,28.87 34.8,33.78 35.7,34.68 42.66,34.68 47.57,29.77 47.57,9.7 v1(49.28,8)
PB9: length 50.4
  Top Layer w0.254: v1(37.99,34.1) 37.93,34.04 35.69,34.04 32.12,30.47 32.12,25.85 32.19,25.78 U1.62
  Bottom Layer w0.254: v1(37.99,34.1) 42.48,34.1 47.22,29.36 47.22,9.04 50.93,5.33 50.93,3.94
PB10: length 19
  Top Layer w0.254: v1(37.97,15.75) 37.69,15.46 U1.30
  Bottom Layer w0.254: v1(37.97,15.75) 37.97,12.45 31.88,6.35 31.88,2.67 30.61,1.4
PB15: length 19.8
  Top Layer w0.254: U1.37 v1(38.2,18.19)
  Bottom Layer w0.254: v1(38.2,18.19) 38.2,16.99 37.39,16.18 37.39,13.01 30.61,6.22 30.61,3.94
PC0: length 41.2
  Top Layer w0.254: U1.8 31.18,20.19 31.56,20.57 v1(32.26,20.57)
  Bottom Layer w0.254: v1(32.26,20.57) 32.14,20.57 25.39,13.82 10.39,13.82 9.18,12.61 9.18,3.39 10.29,2.29 U108.5
PC1: length 39.5
  Top Layer w0.254: v1(33.53,20.32) 32.9,19.69 U1.9
  Bottom Layer w0.254: v1(33.53,20.32) 32.43,19.22 31.3,19.22 25.54,13.46 11.43,13.46 10.29,12.32 U108.6
PC2: length 38.4
  Top Layer w0.254: v1(32.54,18.64) 32.46,18.72 31.07,18.72 30.6,19.19 U1.10
  Bottom Layer w0.254: 12.83,1.4 12.83,2.12 11.39,3.56 11.39,11.52 12.98,13.11 25.68,13.11 31.22,18.64 v1(32.54,18.64)
PC3: length 34.9
  Top Layer w0.254: U1.11 30.6,18.69 31.24,18.05 33.04,18.05 v1(33.15,18.16)
  Bottom Layer w0.254: v1(33.15,18.16) 32.89,18.16 32.78,18.05 32.3,18.05 32.19,18.16 31.24,18.16 25.83,12.75 14.15,12.75 12.83,11.43 12.83,3.94
PC4: length 21.5
  Top Layer w0.254: U1.22 33.69,16.22 v1(33.6,16.31)
  Bottom Layer w0.254: 22.99,1.4 22.99,2.29 24.26,3.56 24.26,5.72 33.66,15.11 33.66,16.25 v1(33.6,16.31)
PC5: length 19.5
  Top Layer w0.254: U1.23 34.19,16.16 34.84,16.81 v1(34.84,16.82)
  Bottom Layer w0.254: 25.28,4.19 25.53,4.44 25.53,6.48 34.8,15.75 34.8,16.82 v1(34.84,16.82)
PC6: length 23.2
  Top Layer w0.254: v1(39.37,18.77) 39.45,18.69 U1.38
  Bottom Layer w0.254: v1(39.37,18.77) 39.47,18.67 40.63,18.67 40.88,18.42 40.88,12.85 34.54,6.51 34.54,3.05 33.15,1.65 33.15,1.4
PC7: length 20
  Top Layer w0.254: U1.39 39.9,19.19 39.52,19.57 v1(38.74,19.57)
  Bottom Layer w0.254: v1(38.74,19.57) 38.79,19.52 38.79,11.26 33.15,5.62 33.15,3.94
PC12: length 40
  Top Layer w0.254: v1(37.97,29.85) 36.77,29.85 36.19,29.27 U1.54
  Bottom Layer w0.254: v1(37.97,29.85) 41.53,29.85 44.03,27.34 44.03,8.73 42.08,6.77 42.08,3.43 43.31,2.2 U108.31
PC13: length 61.9
  Top Layer w0.254: U1.2 30.41,23.19 v1(30.53,23.31)
  Bottom Layer w0.254: U108.39 52.36,2.5 52.36,6.48 48.18,10.65 48.18,20.46 47.93,20.71 47.93,21.2 48.18,21.45 48.18,30.43 43.57,35.04 34.91,35.04 34.11,34.24 33.92,34.24 33.58,33.9 33.58,33.71 31.98,32.11 31.73,32.11 31.39,31.77 31.39,31.29 31.39,31.28 31.39,24.4 31.14,24.15 31.14,23.67 30.78,23.31 v1(30.53,23.31)
PD2: length 38.4
  Top Layer w0.254: v1(38.64,30.43) 36.65,30.43 35.69,29.46 U1.55
  Bottom Layer w0.254: v1(38.64,30.43) 41.96,30.43 44.39,28 44.39,8.45 43.31,7.37 U108.32
RESET: length 40.2
  Top Layer w0.254: v1(30.99,20.83) 30.85,20.69 U1.7 ; v1(40.26,24.89) 40.26,27.56 40.89,28.19 C98.2 51.56,28.26 51.56,31.75 52.07,32.26 52.95,32.26 ; 52.95,32.26 R14.2 ; 52.95,32.26 RESET.2
  Bottom Layer w0.254: v1(30.99,20.83) 31.5,21.34 31.5,24 32.38,24.89 v1(40.26,24.89)
SWCLK: length 29.3
  Top Layer w0.254: U1.50 38.23,25.68 38.23,26.31 37.77,26.76 v1(37.77,27.48) ; 53.85,17.79 56.12,17.79 U104.3 ; 53.85,17.79 53.85,23.24 52.96,24.13 48.26,24.13 46.2,26.19 v1(42.7,26.19) ; 53.85,17.79 R7.2
  Bottom Layer w0.254: v1(37.77,27.48) 38.11,27.81 39.88,27.81 41.5,26.19 v1(42.7,26.19)
SWDIO: length 28.4
  Top Layer w0.254: v1(41.85,25.61) 45.39,25.61 47.5,23.5 51.18,23.5 51.82,22.86 51.82,19.89 51.56,19.64 51.56,17.15 52.71,16 52.71,15.23 ; 52.71,15.23 56.06,15.23 U104.2 ; 52.71,15.23 52.65,15.18 52.64,15.18 52.59,15.23 R13.2 ; U1.49 38.69,27.19 v1(38.64,27.23)
  Bottom Layer w0.254: v1(41.85,25.61) 41.77,25.68 41.12,25.68 39.57,27.23 v1(38.64,27.23)
USART3_RX: length 24.1
  Top Layer w0.254: U104.6 56.03,25.41 49.13,25.41 46.97,27.56 v1(42.55,27.56) ; v1(37.59,29.08) 37.34,29.08 36.69,28.43 U1.53
  Bottom Layer w0.254: v1(42.55,27.56) 41.03,29.08 v1(37.59,29.08)
USART3_TX: length 23.5
  Top Layer w0.254: v1(41.91,26.78) 46.64,26.78 48.65,24.77 53.81,24.77 55.78,22.8 U104.5 ; v1(37.75,28.29) 37.19,27.72 U1.52
  Bottom Layer w0.254: v1(41.91,26.78) 41.87,26.78 40.36,28.29 v1(37.75,28.29)
VREF+: length 7.9
  Top Layer w0.254: U106.2 35.69,12 C109.2 37.4,12.07 C110.2 37.47,12.57 36.69,13.35 U1.28
$1N2899: length 1.5
  Top Layer w0.254: 2.68,14.58 2.68,13.08 LED1.2
$1N3104: length 1.5
  Top Layer w0.254: LED2.2 29.21,12.58

## Copper pours and planes (outline as drawn; the poured copper is in the pictures)
AGND on Top Layer: 41.5,10 41.5,11.3 36.6,11.3 36.32,11.02 36.32,8 36.07,7.75 35.31,7.75 34.8,8.26 34.8,9.81 35.08,10.09 35.08,11.28 34.93,11.43 34.93,12.69 35.8,12.69 36.32,13.08 36.32,15.11 36.19,15.24 35.94,15.24 35.81,15.11 35.81,13.59 35.56,13.34 32.13,13.34 31.62,12.83 31.62,11.3 31.24,10.92 31.24,9.4 31.12,9.27 34.04,9.27 34.16,9.14 34.16,7.87 34.93,7.11 36.58,7.11 37.21,7.75 37.21,9.53 37.34,9.65 41.4,9.65 41.53,9.78 41.53,9.98
GND on Top Layer: -11.68,40.39 69.34,40.39 69.34,-17.14 -11.68,-17.14
GND on Bottom Layer: -15.11,53.09 74.42,53.09 74.42,-13.46 -15.11,-13.46

Small or netless copper shapes (teardrops, artwork), in the pictures only: 270 on Top Layer, 80 on Bottom Layer

## Text on the board
Bottom Silkscreen Layer: 5V | GND | C1 | C0 | C3 | C2 | A1 | A0 | A4 | A2 | A5 | A6 | A7 | C4 | C5 | B0 | B1 | B2 | B15 | B10 | C7 | C6 | A9 | A8 | A11 | A10 | A15 | A12 | D2 | C12 | B4 | B3 | B6 | B5 | B9 | B7 | C13
Top Silkscreen Layer: 5V | GND | C0 | C1 | C3 | C2 | A0 | A1 | A4 | A2 | A5 | A6 | A7 | C4 | C5 | B0 | B2 | B1 | B15 | B10 | C7 | C6 | A9 | A8 | A11 | A10 | A15 | A12 | C12 | D2 | B4 | B3 | B6 | B5 | B9 | B7 | C13 | 3V3 | SCL | SDA | CLK | DIO | RX | TX
